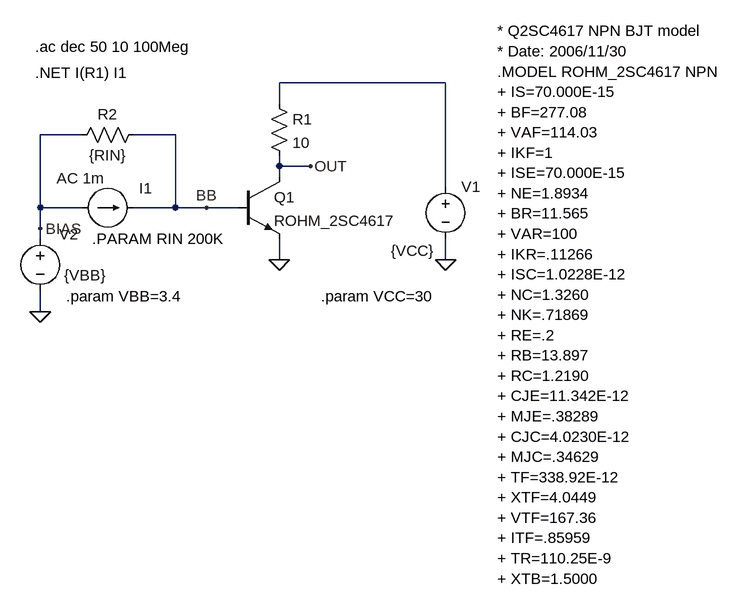
[diagram p0: schematic Fig_3-44_rohm_2sc4617_hfe_ac-3.asc]
Fig_3-44_rohm_2sc4617_hfe_ac-3.asc, the LTspice schematic file:
Version 4
SHEET 1 1076 1108
WIRE 496 -32 240 -32
WIRE 240 0 240 -32
WIRE -64 48 -128 48
WIRE 80 48 16 48
WIRE 240 96 240 80
WIRE 288 96 240 96
WIRE 240 112 240 96
WIRE 496 128 496 -32
WIRE -128 160 -128 48
WIRE -64 160 -128 160
WIRE 80 160 80 48
WIRE 80 160 16 160
WIRE 128 160 80 160
WIRE 176 160 128 160
WIRE -128 192 -128 160
WIRE -128 208 -128 192
WIRE 240 240 240 208
WIRE 496 240 496 208
WIRE -128 320 -128 288
FLAG -128 320 0
FLAG 240 240 0
FLAG 496 240 0
FLAG 288 96 OUT
FLAG -128 192 BIAS
FLAG 128 160 BB
SYMBOL npn 176 112 R0
SYMATTR InstName Q1
SYMATTR Value ROHM_2SC4617
SYMBOL voltage 496 112 R0
WINDOW 123 0 0 Left 2
WINDOW 39 0 0 Left 2
WINDOW 3 -84 114 Left 2
SYMATTR Value {VCC}
SYMATTR InstName V1
SYMBOL res 224 -16 R0
SYMATTR InstName R1
SYMATTR Value 10
SYMBOL voltage -128 192 R0
WINDOW 123 24 138 Left 2
WINDOW 39 24 117 Left 2
WINDOW 0 29 9 Left 2
WINDOW 3 37 72 Left 2
SYMATTR InstName V2
SYMATTR Value {VBB}
SYMBOL res -80 64 R270
WINDOW 0 32 56 VTop 2
WINDOW 3 0 56 VBottom 2
SYMATTR InstName R2
SYMATTR Value {RIN}
SYMBOL current -64 160 R270
WINDOW 0 30 88 VRight 2
WINDOW 3 24 0 Left 2
WINDOW 123 45 -39 VRight 2
WINDOW 39 0 0 Left 2
SYMATTR InstName I1
SYMATTR Value ""
SYMATTR Value2 AC 1m
TEXT -88 296 Left 2 !.param VBB=3.4
TEXT -136 -88 Left 2 !.ac dec 50 10 100Meg
TEXT -136 -48 Left 2 !.NET I(R1) I1
TEXT 304 296 Left 2 !.param VCC=30
TEXT 576 -112 Left 2 !* Q2SC4617 NPN BJT model\n* Date: 2006/11/30\n.MODEL ROHM_2SC4617 NPN\n+ IS=70.000E-15\n+ BF=277.08\n+ VAF=114.03\n+ IKF=1\n+ ISE=70.000E-15\n+ NE=1.8934\n+ BR=11.565\n+ VAR=100\n+ IKR=.11266\n+ ISC=1.0228E-12\n+ NC=1.3260\n+ NK=.71869\n+ RE=.2\n+ RB=13.897\n+ RC=1.2190\n+ CJE=11.342E-12\n+ MJE=.38289\n+ CJC=4.0230E-12\n+ MJC=.34629\n+ TF=338.92E-12\n+ XTF=4.0449\n+ VTF=167.36\n+ ITF=.85959\n+ TR=110.25E-9\n+ XTB=1.5000
TEXT -48 208 Left 2 !.PARAM RIN 200K

The netlist it stands for:
* Fig_3-44_rohm_2sc4617_hfe_ac-3.asc
Q1 OUT BB 0 0 ROHM_2SC4617
V1 N001 0 {VCC}
R1 N001 OUT 10
V2 BIAS 0 {VBB}
R2 BIAS BB {RIN}
I1 BIAS BB AC 1m
.model NPN NPN
.model PNP PNP
.lib standard.bjt
.param VBB=3.4
.ac dec 50 10 100Meg
.NET I(R1) I1
.param VCC=30
* Q2SC4617 NPN BJT model
* Date: 2006/11/30
.MODEL ROHM_2SC4617 NPN
+ IS=70.000E-15
+ BF=277.08
+ VAF=114.03
+ IKF=1
+ ISE=70.000E-15
+ NE=1.8934
+ BR=11.565
+ VAR=100
+ IKR=.11266
+ ISC=1.0228E-12
+ NC=1.3260
+ NK=.71869
+ RE=.2
+ RB=13.897
+ RC=1.2190
+ CJE=11.342E-12
+ MJE=.38289
+ CJC=4.0230E-12
+ MJC=.34629
+ TF=338.92E-12
+ XTF=4.0449
+ VTF=167.36
+ ITF=.85959
+ TR=110.25E-9
+ XTB=1.5000
.PARAM RIN 200K
.backanno
.end